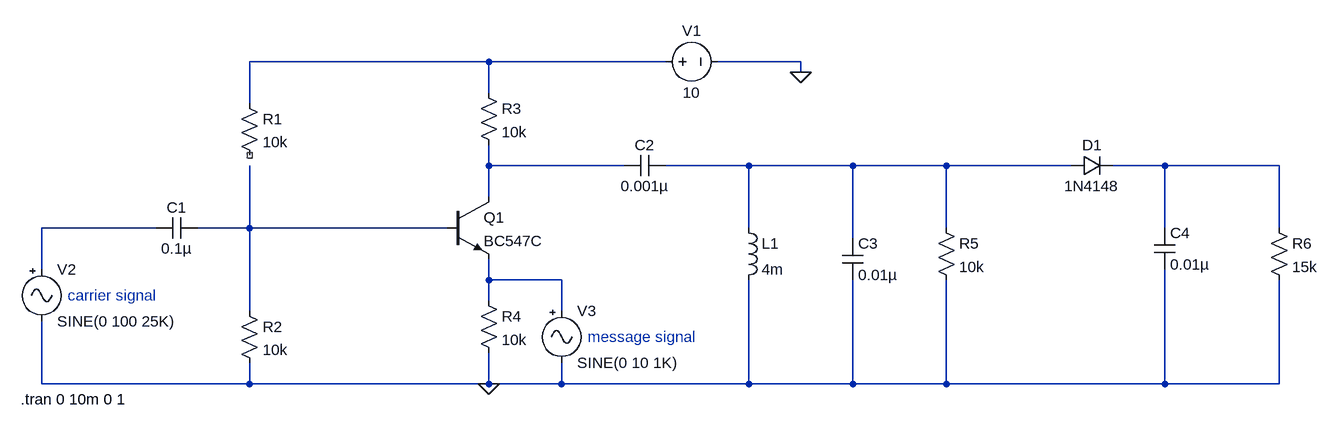
[diagram p0: schematic MOD-DEMOD.asc]
MOD-DEMOD.asc, the LTspice schematic file:
Version 4.1
SHEET 1 2052 680
WIRE 464 48 96 48
WIRE 736 48 464 48
WIRE 944 48 816 48
WIRE 944 64 944 48
WIRE 464 96 464 48
WIRE 96 112 96 48
WIRE 464 208 464 176
WIRE 672 208 464 208
WIRE 864 208 736 208
WIRE 1024 208 864 208
WIRE 1168 208 1024 208
WIRE 1360 208 1168 208
WIRE 1504 208 1424 208
WIRE 1680 208 1504 208
WIRE 464 256 464 208
WIRE -48 304 -224 304
WIRE 96 304 96 208
WIRE 96 304 16 304
WIRE 400 304 96 304
WIRE 864 304 864 208
WIRE 1168 304 1168 208
WIRE 1504 304 1504 208
WIRE 1680 304 1680 208
WIRE 1024 320 1024 208
WIRE -224 368 -224 304
WIRE 464 384 464 352
WIRE 576 384 464 384
WIRE 464 416 464 384
WIRE 96 432 96 304
WIRE 576 432 576 384
WIRE -224 544 -224 448
WIRE 96 544 96 512
WIRE 96 544 -224 544
WIRE 464 544 464 496
WIRE 464 544 96 544
WIRE 576 544 576 512
WIRE 576 544 464 544
WIRE 864 544 864 384
WIRE 864 544 576 544
WIRE 1024 544 1024 384
WIRE 1024 544 864 544
WIRE 1168 544 1168 384
WIRE 1168 544 1024 544
WIRE 1504 544 1504 368
WIRE 1504 544 1168 544
WIRE 1680 544 1680 384
WIRE 1680 544 1504 544
FLAG 944 64 0
FLAG 464 544 0
SYMBOL res 80 96 R0
SYMATTR InstName R1
SYMATTR Value 10k
SYMBOL res 80 416 R0
SYMATTR InstName R2
SYMATTR Value 10k
SYMBOL res 448 80 R0
SYMATTR InstName R3
SYMATTR Value 10k
SYMBOL res 448 400 R0
SYMATTR InstName R4
SYMATTR Value 10k
SYMBOL voltage 720 48 R270
WINDOW 0 32 56 VTop 2
WINDOW 3 -32 56 VBottom 2
SYMATTR InstName V1
SYMATTR Value 10
SYMBOL cap 16 288 R90
WINDOW 0 0 32 VBottom 2
WINDOW 3 32 32 VTop 2
SYMATTR InstName C1
SYMATTR Value 0.1µ
SYMBOL Misc\\signal -224 352 R0
WINDOW 123 0 0 Left 0
WINDOW 39 0 0 Left 0
SYMATTR InstName V2
SYMATTR Value SINE(0 100 25K)
SYMBOL ind 848 288 R0
SYMATTR InstName L1
SYMATTR Value 4m
SYMBOL npn 400 256 R0
SYMATTR InstName Q1
SYMATTR Value BC547C
SYMBOL cap 672 224 R270
WINDOW 0 32 32 VTop 2
WINDOW 3 0 32 VBottom 2
SYMATTR InstName C2
SYMATTR Value 0.001µ
SYMBOL Misc\\signal 576 416 R0
WINDOW 123 0 0 Left 0
WINDOW 39 0 0 Left 0
SYMATTR InstName V3
SYMATTR Value SINE(0 10 1K)
SYMBOL cap 1008 320 R0
SYMATTR InstName C3
SYMATTR Value 0.01µ
SYMBOL res 1152 288 R0
SYMATTR InstName R5
SYMATTR Value 10k
SYMBOL diode 1360 224 R270
WINDOW 0 32 32 VTop 2
WINDOW 3 0 32 VBottom 2
SYMATTR InstName D1
SYMATTR Value 1N4148
SYMBOL cap 1488 304 R0
SYMATTR InstName C4
SYMATTR Value 0.01µ
SYMBOL res 1664 288 R0
SYMATTR InstName R6
SYMATTR Value 15k
TEXT -256 568 Left 2 !.tran 0 10m 0 1
TEXT -184 408 Left 2 ;carrier signal
TEXT 616 472 Left 2 ;message signal

The netlist it stands for:
* MOD-DEMOD.asc
R1 N001 NC_01 10k
R2 N006 0 10k
R3 N001 N002 10k
R4 N007 0 10k
V1 N001 0 10
C1 N006 N005 0.1µ
V2 N005 0 SINE(0 100 25K)
L1 N003 0 4m
Q1 N002 N006 N007 0 BC547C
C2 N002 N003 0.001µ
V3 N007 0 SINE(0 10 1K)
C3 N003 0 0.01µ
R5 N003 0 10k
D1 N003 N004 1N4148
C4 N004 0 0.01µ
R6 N004 0 15k
.model D D
.lib standard.dio
.model NPN NPN
.model PNP PNP
.lib standard.bjt
.tran 0 10m 0 1
* carrier signal
* message signal
.backanno
.end